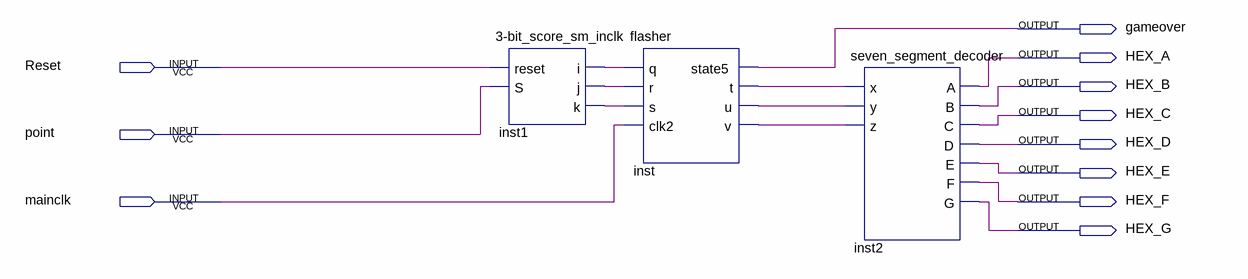
[diagram p0: schematic sheet]
// Quartus schematic scorekeep.bdf as structural Verilog: 3 symbols, 11 pins
module scorekeep (
  input  Reset,
  input  point,
  input  mainclk,
  output gameover,
  output HEX_A,
  output HEX_B,
  output HEX_C,
  output HEX_D,
  output HEX_E,
  output HEX_F,
  output HEX_G
);

  wire inst1_i, inst1_j, inst1_k, inst_t, inst_u, inst_v;

  \3-bit_score_sm_inclk  inst1 (.reset(Reset), .S(point), .i(inst1_i), .j(inst1_j), .k(inst1_k));
  flasher inst (
    .q(inst1_i), .r(inst1_j), .s(inst1_k), .clk2(mainclk), .state5(gameover), .t(inst_t), .u(inst_u),
    .v(inst_v));
  seven_segment_decoder inst2 (
    .x(inst_t), .y(inst_u), .z(inst_v), .A(HEX_A), .B(HEX_B), .C(HEX_C), .D(HEX_D), .E(HEX_E), .F(HEX_F),
    .G(HEX_G));
endmodule
